# EAGLE design headstage-programmer (EAGLE 8.3.2)
DESIGNER: Jon Newman; DESIGN_NAME: Headstage Programmer; LICENSE: CERN OHL v1.2; REVISION: 1.2
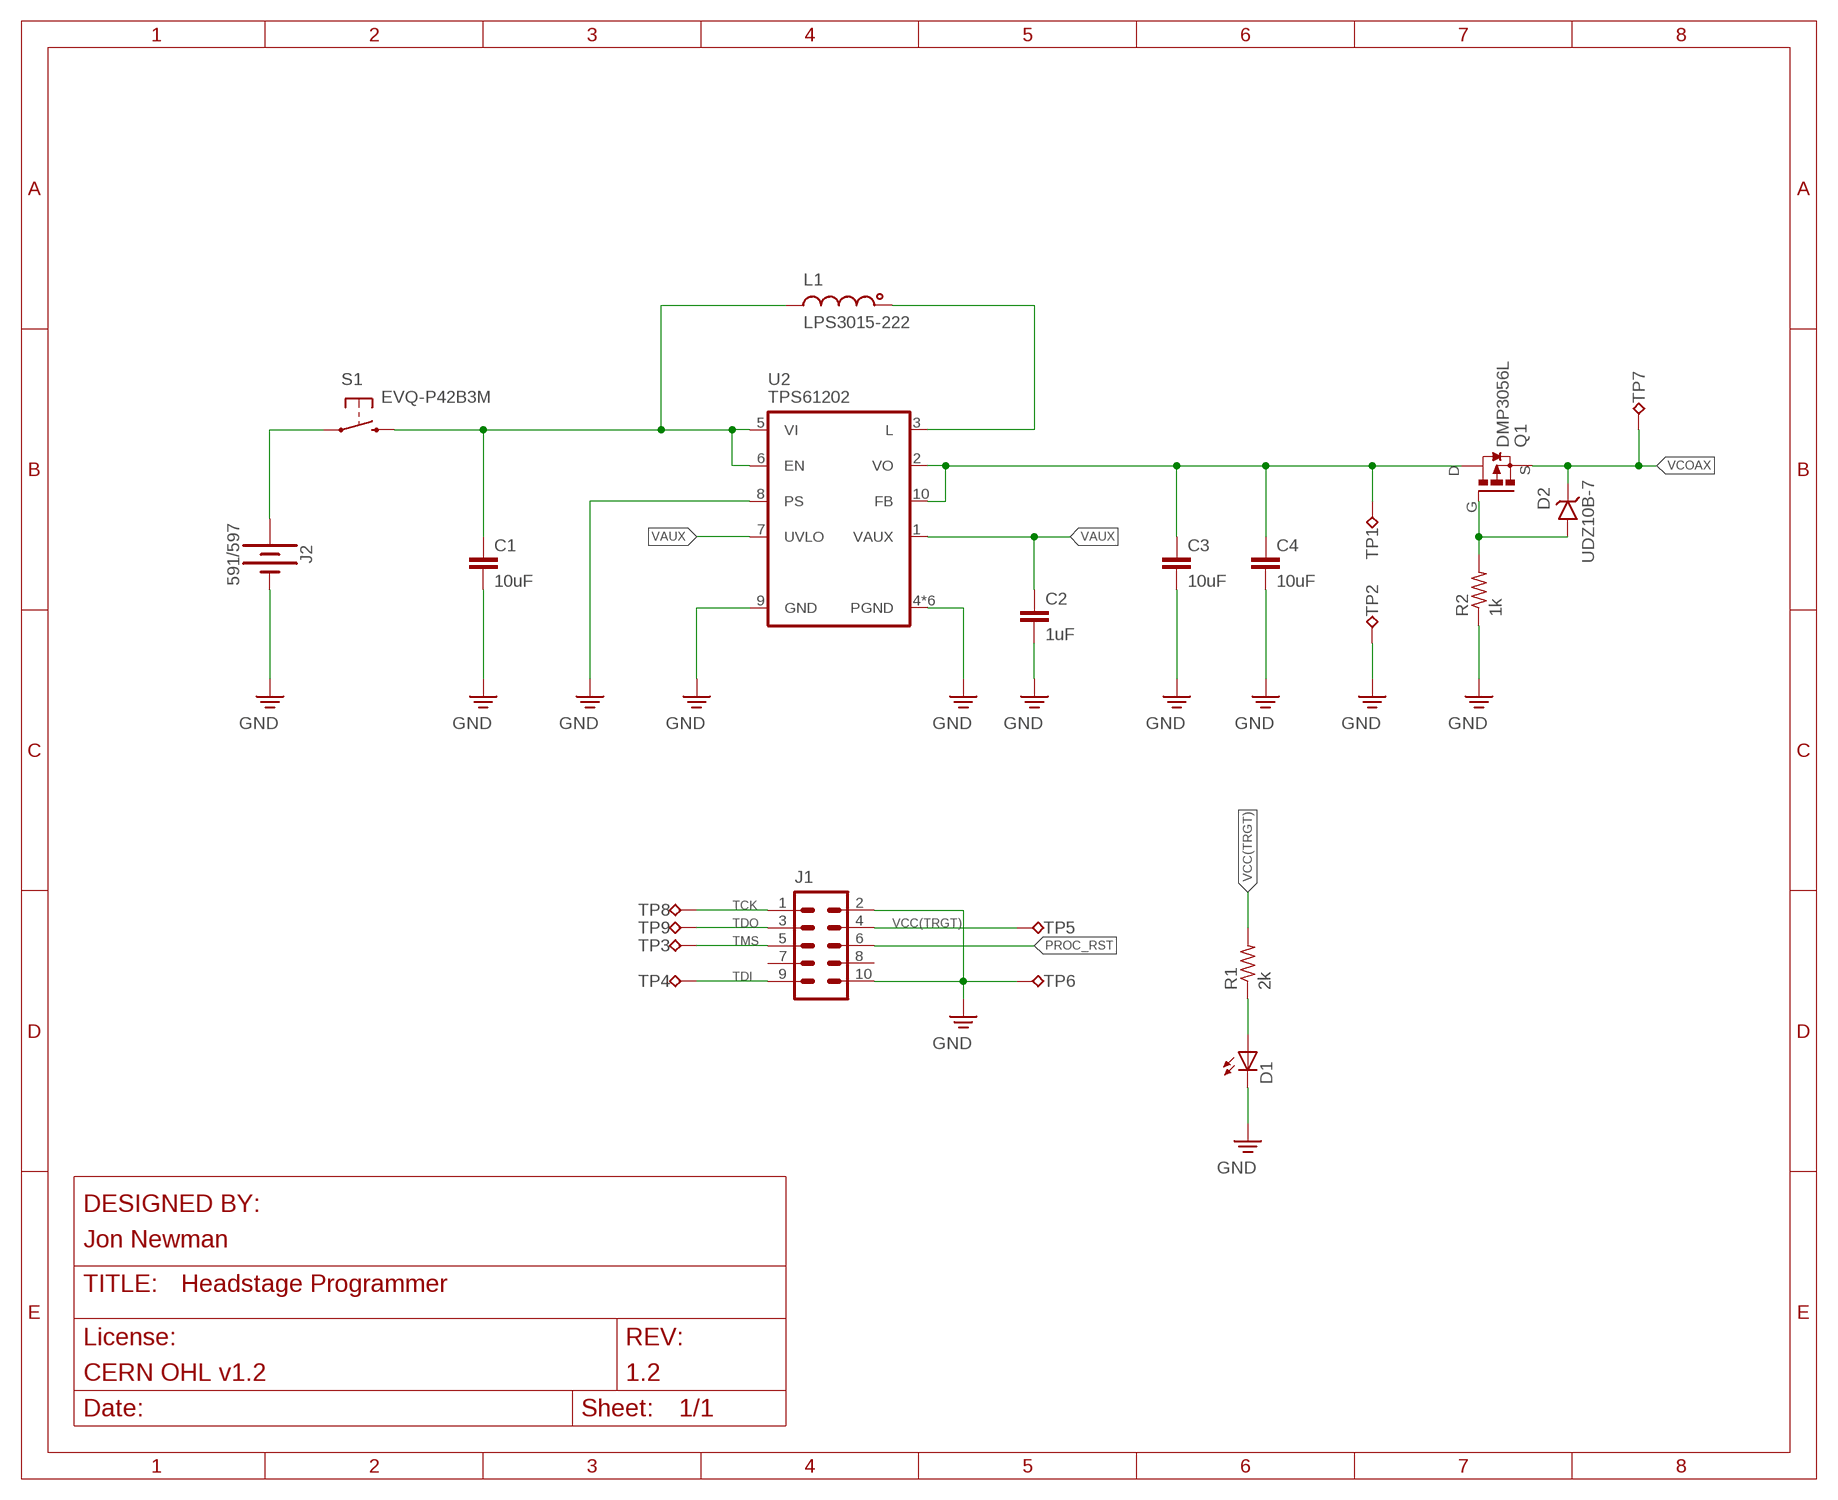
[diagram p0: schematic, sheet 1]

## Parts
C1  10uF  C_0805  [0805]
C2  1uF  C_0603  [0603]
C3  10uF  C_0805  [0805]
C4  10uF  C_0805  [0805]
D1  LED_0603  [LED-0603]
D2  UDZ10B-7  Z-DIODE_SOD-323  [SOD-323]
J1  302-S101  PINHD-2X5_IDC  [2X05_IDC]
J2  591/597  BATTERY_597/591  [597/591_AAA-HOLDER]
L1  LPS3015-222  L_LPS3015  [LPS3015]
Q1  DMP3056L  P-MOSFET_SOT23-GSD  [SOT23-GSD]
R1  2k  R_0603  [0603]
R2  1k  R_0603  [0603]
S1  EVQ-P42B3M  SPST_TACT2_EVQP4  [EVQP4]
TP1  TP_1MM  [TESTPOINT_1MM]
TP2  TP_1MM  [TESTPOINT_1MM]
TP3  TP_S500-6350-P2  [POGO_S500-6350-P2]
TP4  TP_S500-6350-P2  [POGO_S500-6350-P2]
TP5  TP_S500-6350-P2  [POGO_S500-6350-P2]
TP6  TP_S500-6350-P2  [POGO_S500-6350-P2]
TP7  TP_S500-6350-P2  [POGO_S500-6350-P2]
TP8  TP_S500-6350-P2  [POGO_S500-6350-P2]
TP9  TP_S500-6350-P2  [POGO_S500-6350-P2]
U2  TPS61202  TPS61200  [PWSON-N10+4-3X3]

## Nets
GND: C1.2 C2.2 C3.2 C4.2 D1.C J1.2 J1.10 J2.-1(-) J2.-2(-) J2.-3(-) R2.1 TP2.1(TP) TP6.P$1(TP) U2.4(PGND) U2.8(PS) U2.9(GND) U2.PAD1(PGND) U2.PAD2(PGND) U2.PAD3(PGND) U2.PAD4(PGND) U2.PAD(PGND)
N$1: D1.A R1.1
N$3: L1.1 U2.3(L)
N$4: J2.+1(+) J2.+2(+) J2.+3(+) S1.1(P)
N$450: D2.A Q1.G R2.2
PROC_RST: J1.6
TCK: J1.1 TP8.P$1(TP)
TDI: J1.9 TP4.P$1(TP)
TDO: J1.3 TP9.P$1(TP)
TMS: J1.5 TP3.P$1(TP)
VAUX: C2.1 U2.1(VAUX) U2.7(UVLO)
VCC(TRGT): J1.4 R1.2 TP5.P$1(TP)
VCOAX: D2.C Q1.S TP7.P$1(TP)
VIN: C1.1 L1.2 S1.2(S) U2.5(VI) U2.6(EN)
VO: C3.1 C4.1 Q1.D TP1.1(TP) U2.2(VO) U2.10(FB)
Unconnected: J1.7 J1.8

## Library data of the parts
C1 C3 C4 = jonnew:C: Capacitor; MN: TDK Corp.; PARTNO: C2012X5R1Cxxxxxxx; VID: DK
C2 = jonnew:C: Capacitor
D1 = jonnew:LED: Surface mount LED
D2 = jonnew:Z-DIODE: Zener Diode; PARTNO: UDZ10B-7
J1 = jonnew:PINHD-2X5
J2 = jonnew:BATTERY
L1 = jonnew:L: Inductor
Q1 = jonnew:P-MOSFET; PARTNO: DMP3056L-7
R1 R2 = jonnew:R: Resistor; DK: PxxxxHTR-ND; MN: Panasonic; MPN: ERJ-3EKFxxxxV
S1 = jonnew:SPST_TACT2
TP1-TP9 = jonnew:TP: Test pad
U2 = jonnew:TPS61200

## Board
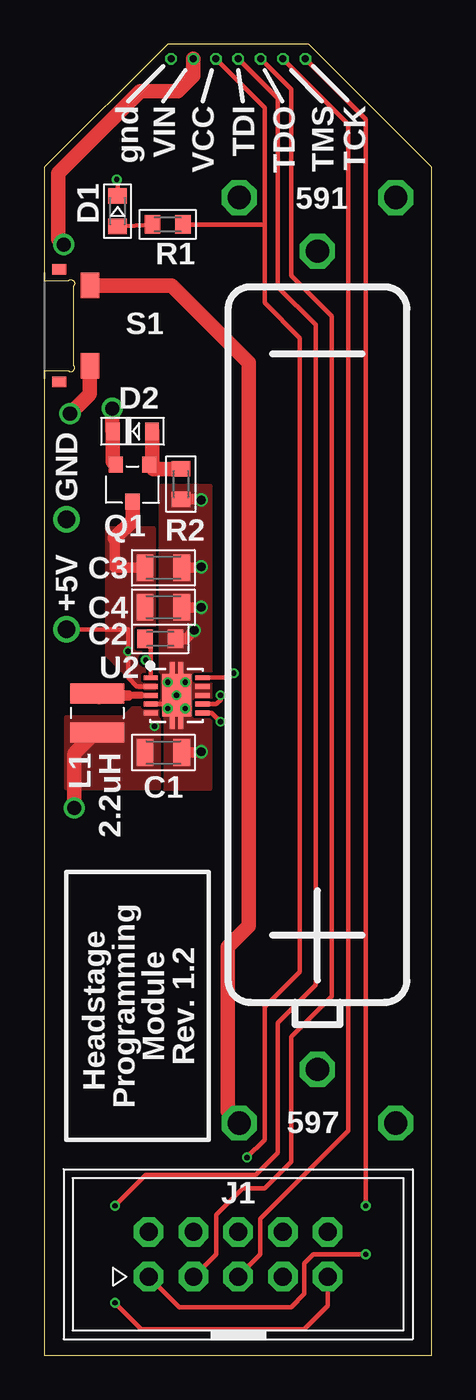
[diagram p1: board, top side]
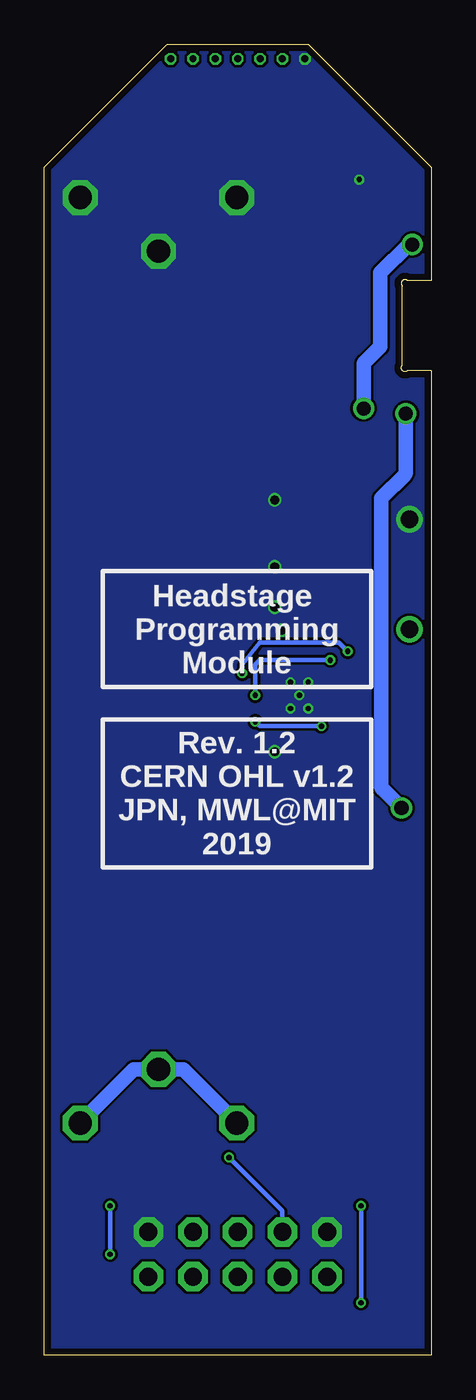
[diagram p2: board, bottom side, seen from below]

Size 22 x 74.5 mm. Coordinates in mm from the lower left corner, seen from the top.
Outline: 0,61.05 0,67.5 7,74.5 15,74.5 22,67.5 22,0 0,0 0,55.95
Copper layers (1*16): Top 0.0356mm / dielectric 1.5011mm / Bottom 0.0356mm
Design rules "ohs-park-2-layer": minimum track width 6mil, minimum drill 10mil, track to track 6mil, track to pad 6mil, pad to pad 6mil, via to via 6mil, smd to smd 6mil, copper to edge 15mil, drill to drill 6mil, minimum pad ring 5mil, minimum via ring 5mil, stop-mask expansion 4mil, vias tented up to drill 100mil, thermal gap 10mil

### Footprints (pad centres in the part's own frame; a part is rotated, then mirrored left to right if it is on the bottom)
0805 = smd 0.965 x 1.524: 1 -1.041,0; 2 1.041,0
0603 = smd 0.889 x 1.067: 1 -0.864,0; 2 0.864,0
LED-0603 = smd 1.067 x 0.889: A 0,-0.864; C 0,0.864
SOD-323 = smd 0.762 x 1.016: A -1.118,0; C 1.118,0
2X05_IDC = drill 1.016 pad 1.676 octagon: 1 -5.08,-1.27; 2 -5.08,1.27; 3 -2.54,-1.27; 4 -2.54,1.27; 5 0,-1.27; 6 0,1.27; 7 2.54,-1.27; 8 2.54,1.27; 9 5.08,-1.27; 10 5.08,1.27
597/591_AAA-HOLDER = drill 1.321 octagon: +1 -4.445,3.048; +2 0,0; +3 4.445,3.048; -1 -4.445,-49.53; -2 0,-46.482; -3 4.445,-49.53
LPS3015 = smd 1.14 x 3.05: 1 -1.1,0; 2 1.1,0
SOT23-GSD = smd 0.8 x 0.9: D 0,0; G -0.95,-2.1; S 0.95,-2.1
EVQP4 = smd 1.45 x 1.05: 1 -2.275,2.575; 2 2.275,2.575 | smd 0.6 x 0.8: 3 -3.2,0.85; 4 3.2,0.85
TESTPOINT_1MM = drill 1: 1 0,0
POGO_S500-6350-P2 = drill 0.396 octagon: P$1 0,0
PWSON-N10+4-3X3 = smd 0.8 x 0.28: 1 -1.475,1; 2 -1.475,0.5; 3 -1.475,0; 4 -1.475,-0.5; 5 -1.475,-1; 6 1.475,-1; 7 1.475,-0.5; 8 1.475,0; 9 1.475,0.5; 10 1.475,1 | smd 1.65 x 2.4: PAD 0,0 | smd 0.28 x 0.7: PAD1 -0.25,1.55; PAD2 0.25,1.55; PAD3 0.25,-1.55; PAD4 -0.25,-1.55

### Placement (x,y rotation side)
C1  6.75,34.25 0 top
C2  6.57,40.71 0 top
C3  6.75,44.75 0 top
C4  6.75,42.5 0 top
D1  4.15,65 0 top
D2  5,52.5 180 top
J1  11,5.75 0 top
J2  15.5,16.25 180 top
L1  3,36.5 270 top
Q1  5,48.5 180 top
R1  7,64.25 0 top
R2  7.75,49.5 90 top
S1  0,58.5 270 top
TP1  1.25,41.25 0 top
TP2  1.25,47.5 0 top
TP3  13.54,73.66 180 top
TP4  11,73.66 180 top
TP5  9.73,73.66 180 top
TP6  7.19,73.66 180 top
TP7  8.46,73.66 180 top
TP8  14.81,73.66 180 top
TP9  12.27,73.66 180 top
U2  7.5,37.5 0 top

### Tracks (layer width: path | path; a pad name or v marks a point on that pad's centre or on a via)
GND  (via drill 0.3, 0.5)
  Top 0.254: U2.4 6.75,37 v7,36.75 | D1.C 4.15,66.75 v4.1,66.8
  Top 0.61: R2.1 8.9,48.64 v8.9,48.6 | C3.2 8.9,44.75 v8.9,44.8 | C4.2 v8.9,42.5 | C1.2 8.9,34.25 v8.9,34.3 | C2.2 8.01,40.71 v8.5,41.2
  other vias: 7,38.25 8,38.25 8,36.75 7.5,37.5
  pour Bottom (no thermals): -17.75,-12 -17.75,93.75 40,93.75 40,-12
  pour Top (rank 3, no thermals): 6.6,32.2 6.6,49.4 9.4,49.4 9.4,32.2
N$1
  Top 0.254: R1.1 D1.A
N$3
  Top 0.254: U2.3 5.5,37.5
  Top 0.406: 5.5,37.5 4.75,37.5
  Top 0.61: 4.75,37.5 3.1,37.5
  Top 1.016: 3.1,37.5 L1.1
N$4
  Top 0.813: S1.1 7.22,60.77 11.6,56.4 11.6,24.4 10.4,23.2 10.4,13.86 J2.+3
  Bottom 0.813: J2.+3 14.1,16.25 J2.+2 16.9,16.25 J2.+1
N$450
  Top 0.61: 6.19,50.36 Q1.G 6.12,50.77
  Top 0.813: 6.19,50.36 R2.2 | 6.12,50.77 D2.A
TCK  (via drill 0.3)
  Top 0.254: J1.1 7.65,2.75 14,2.75 14.75,3.5 14.75,5.25 15.25,5.75 v18.25,5.75 | 18.25,68.25 v18.25,8.5 | 18.25,68.25 18.25,69.5 | TP8.P$1 18.25,70.22 18.25,68.25
  Bottom 0.254: v18.25,5.75 v18.25,8.5
TDI  (via drill 0.3)
  Top 0.254: v4,8.5 5.75,10.25 12,10.25 13.25,11.5 13.25,18.9 15.4,21.05 15.4,58.55 13.25,60.7 13.25,71.41 TP4.P$1 | v4,3 5.5,1.5 14.75,1.5 16.08,2.83 J1.9
  Bottom 0.254: v4,8.5 v4,3
TDO
  Top 0.254: J1.3 8.48,4.48 9.75,5.75 9.75,8 11.25,9.5 12.5,9.5 14,11 14,18.1 16.3,20.4 16.3,59.05 14,61.35 14,71.93 TP9.P$1
TMS
  Top 0.254: J1.5 11,4.5 12.25,5.75 12.25,7.75 17.25,12.75 17.25,68.75 | 17.25,68.75 17.25,69.5 | TP3.P$1 17.25,69.95 17.25,68.75
VAUX  (via drill 0.3)
  Top 0.254: C2.1 6.03,40.14 6.03,39.5 | 6.03,39.5 U2.1 | v5.75,39.5 6.03,39.5 | U2.7 9.75,37 10,37.25 v10,37.5
  Bottom 0.254: v5.75,39.5 9.75,39.5 10,39.25 v10,37.5
VCC(TRGT)  (via drill 0.3)
  Top 0.254: v11.5,11.25 12.5,12.25 12.5,19.8 14.5,21.8 14.5,53.8 | 12.5,64.25 12.5,70.89 TP5.P$1 | R1.2 12.5,64.25 | 14.5,53.8 14.5,57.8 12.5,59.8 12.5,64.25 | 14.5,53.8 14.5,53.1
  Bottom 0.254: J1.4 8.46,8.21 v11.5,11.25
VCOAX  (via drill 0.8)
  Top 0.813: Q1.S 3.88,50.77 D2.C arc-45 3.85,52.58 v3.85,53.8 | TP7.P$1 8.46,72.7 7.58,71.82 5.43,71.82 0.79,67.17 0.79,63.41 v1.09,63.11
  Bottom 0.813: v3.85,53.8 3.85,56.24 arc45 3.78,56.42 2.9,57.3 2.9,61.5 1.29,63.11 v1.09,63.11
VIN  (via drill 0.3, 0.8)
  Top 0.254: U2.6 9.5,36.5 v10,36
  Top 0.813: L1.2 3,35.5 1.77,34.27 arc45 1.7,34.09 v1.7,31.1 | S1.2 2.57,54.73 arc-45 2.5,54.55 v1.45,53.5
  Bottom 0.254: v6.25,35.75 9.75,35.75 v10,36
  Bottom 0.813: v1.45,53.5 1.45,50.2 arc45 1.52,50.03 2.85,48.7 2.85,32.35 arc-45 2.78,32.18 v1.7,31.1
  pour Top (no thermals): 6.5,36.75 5,36.75 4.5,36.25 1.25,36.25 1.25,32.25 6.5,32.25
VO  (via drill 0.3)
  Top 0.254: v10.75,38.75 10.5,38.5 U2.10 | U2.2 5.25,38 4.75,38.5 v4.75,40 4.75,41.25 TP1.1
  Top 0.61: 4,46.44 4,44.75 C3.1
  Top 0.813: Q1.D 5,47.44 4,46.44
  Bottom 0.254: v10.75,38.75 10.75,39.25 9.75,40.5 5.25,40.5 v4.75,40
  pour Top (rank 2, no thermals): 6.25,37.75 6.25,47 3.5,47 3.5,39.75 5.5,37.75

### Text on the board
tPlace: gnd | VIN | VCC | TDI | TDO | TMS | TCK | 591 | GND | +5V | 2.2uH | Headstage / Programming / Module / Rev. 1.2 | 597
bPlace: Headstage / Programming / Module | Rev. 1.2 / CERN OHL v1.2 / JPN, MWL@MIT / 2019